# Altium schematic sheet TS-1187A-B-A-B1_TS-1187A-B-A-B.schdoc.schdoc
size 127 x 99 mm
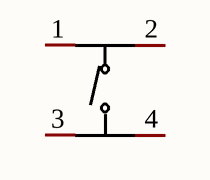
[diagram p0: TS-1187A-B-A-B1_TS-1187A-B-A-B.schdoc.schdoc]

## Parts
SW?  TS-1187A-B-A-B  [SW-SMD_4P-L5.1-W5.1-P3.70-LS6.5-TL-2]  (value not drawn)

## Nets

Not connected (* = marked no-connect by the designer): SW? 1(A) 2(B) 3(C) 4(D)

## Library data of the parts
SW? = TS-1187A-B-A-B: Manufacturer: XKB Connectivity(中国星坤); Add into BOM: yes; Circuit: SPST; Actuator Style: Round Button; Operating Force: 160gf; Switch Length: 5.1mm; Switch Height: 1.5mm; Strike Gundam: 不带; Contact Current: 50mA; Voltage Rating (DC): 12V; Actuator/Cap Color: 金色; With Lamp: No; Mechanical Life: 10万次; Symbol: TS-1187A-B-A-B; Device: TS-1187A-B-A-B; Supplier: LCSC; Supplier Part: C318884; Manufacturer Part: TS-1187A-B-A-B; JLCPCB Part Class: Basic Part; LCSC Part Name: 5.1*5.1*1.5mm 立贴 轻触开关; Supplier Footprint: SMD; Datasheet: https://atta.szlcsc.com/upload/public/pdf/source/20200227/C318890_053E50208A88A7BA1965D8746000774E.pdf; Convert to PCB: yes; Mounting Style: Brick nogging; Switch Width: 5.1mm; Insulation Resistance: -; Operating Temperature: -30℃~+85℃